# Altium schematic sheet ESP32.SchDoc
size A4; SheetNumber: 1; SheetTotal: 6
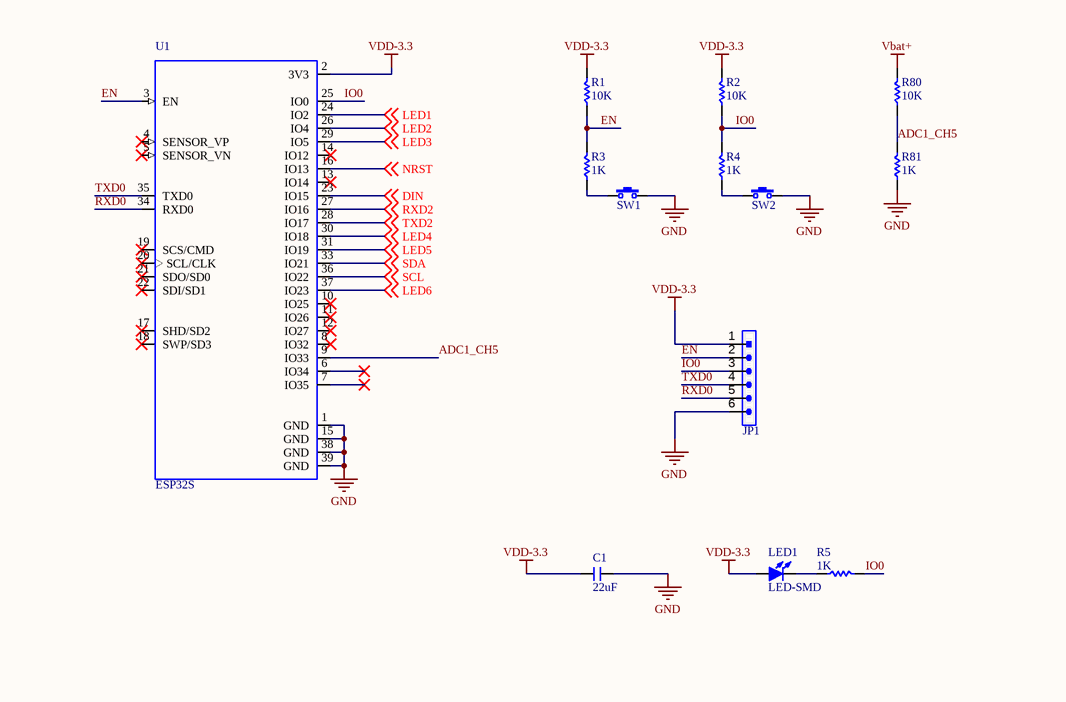
[diagram p0: ESP32.SchDoc]

## Parts
C1  22uF  [C 0805]
JP1  HDR-1X6  [HDR-1X6]  (value not drawn)
LED1  LED-SMD  [LED 0805B]
R1  10K  [R 0805]
R2  10K  [R 0805]
R3  1K  [R 0805]
R4  1K  [R 0805]
R5  1K  [R 0805]
R80  10K  [R 0805]
R81  1K  [R 0805]
SW1  3x6x5  [TSW SMD-3*6*2.5]  (value not drawn)
SW2  3x6x5  [TSW SMD-3*6*2.5]  (value not drawn)
U1  ESP32S  [ESP32S]

## Nets
GND: C1.2 JP1.6 R81.1 SW1.2 SW2.2 U1.1(GND) U1.15(GND) U1.38(GND) U1.39(GND)
Vbat+: R80.2
VDD-3.3: C1.1 JP1.1 LED1.1(A) R1.2 R2.2 U1.2(3V3)
ADC1_CH5: R80.1 R81.2 U1.9(IO33)
DIN: U1.23(IO15) ; off-sheet DIN
EN: JP1.2 R1.1 R3.2 U1.3(EN)
IO0: JP1.3 R2.1 R4.2 R5.2 U1.25(IO0)
LED1: U1.24(IO2) ; off-sheet LED1
LED2: U1.26(IO4) ; off-sheet LED2
LED3: U1.29(IO5) ; off-sheet LED3
LED4: U1.30(IO18) ; off-sheet LED4
LED5: U1.31(IO19) ; off-sheet LED5
LED6: U1.37(IO23) ; off-sheet LED6
NRST: U1.16(IO13) ; off-sheet NRST
RXD0: JP1.5 U1.34(RXD0)
RXD2: U1.27(IO16) ; off-sheet RXD2
SCL: U1.36(IO22) ; off-sheet SCL
SDA: U1.33(IO21) ; off-sheet SDA
TXD0: JP1.4 U1.35(TXD0)
TXD2: U1.28(IO17) ; off-sheet TXD2
NetLED1_2: LED1.2(K) R5.1
NetR3_1: R3.1 SW1.1
NetR4_1: R4.1 SW2.1

Not connected (* = marked no-connect by the designer): U1 4(SENSOR_VP)* 5(SENSOR_VN)* 6(IO34)* 7(IO35)* 8(IO32)* 10(IO25)* 11(IO26)* 12(IO27)* 13(IO14)* 14(IO12)* 17(SHD/SD2)* 18(SWP/SD3)* 19(SCS/CMD)* 20(SCL/CLK)* 21(SDO/SD0)* 22(SDI/SD1)*

## Library data of the parts
C1 = C: Non-polar patch capacitor; BOM名称: 无极性贴片电容; 版权归属: 源创客; 学习资源: www.ooocke.com
JP1 = Header 6: 6P Connector; BOM名称: 6P接插件; 版权归属: 源创客; 学习资源: www.ooocke.com
LED1 = LED-SMD: Patch LED; BOM名称: 贴片LED; 版权归属: 源创客; 学习资源: www.ooocke.com
R1-R5 R80 R81 = R: Chip resistor; 版权归属: 源创客; BOM名称: Chip resistor; 学习资源: www.ooocke.com
SW1 SW2 = TSW 3x6: 3x6 tact switch; BOM名称: 3x6轻触开关; 版权归属: 源创客; 学习资源: www.ooocke.com
U1 = ESP32S: MP: ESP32-WROOM-32D; MF: Espressif Systems; Package: Module Espressif Systems; Price: None; Availability: Unavailable; SnapEDA_Link: https://www.snapeda.com/parts/ESP32-WROOM-32D/Espressif%20Systems/view-part/?ref=snap; Value: *